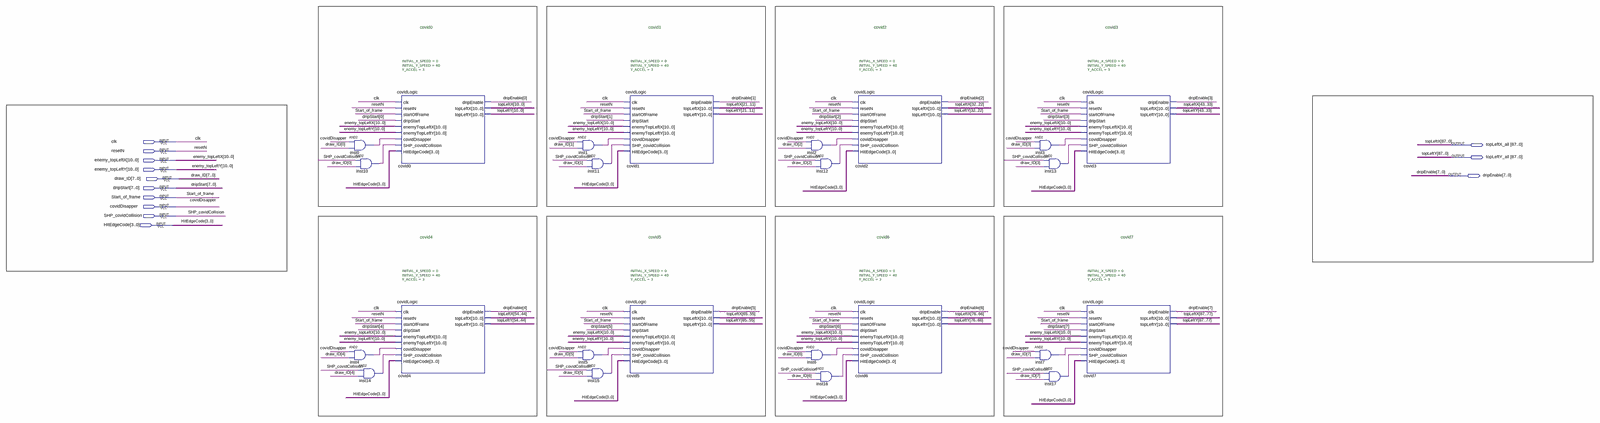
[diagram p0: schematic sheet, whole]
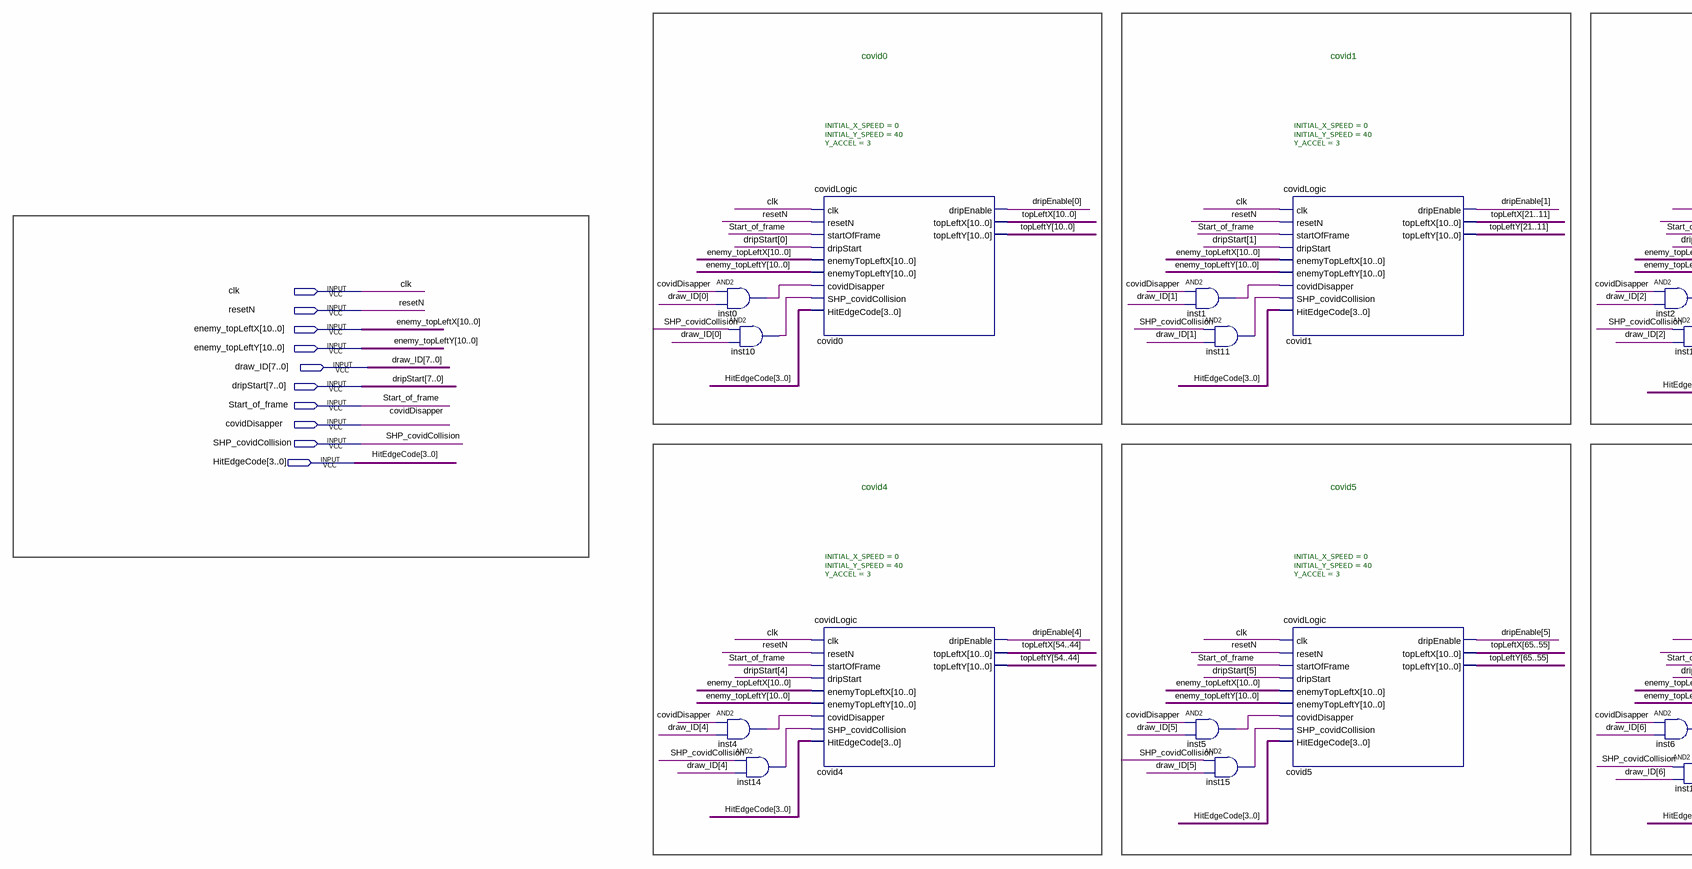
[diagram p1: schematic sheet, left part]
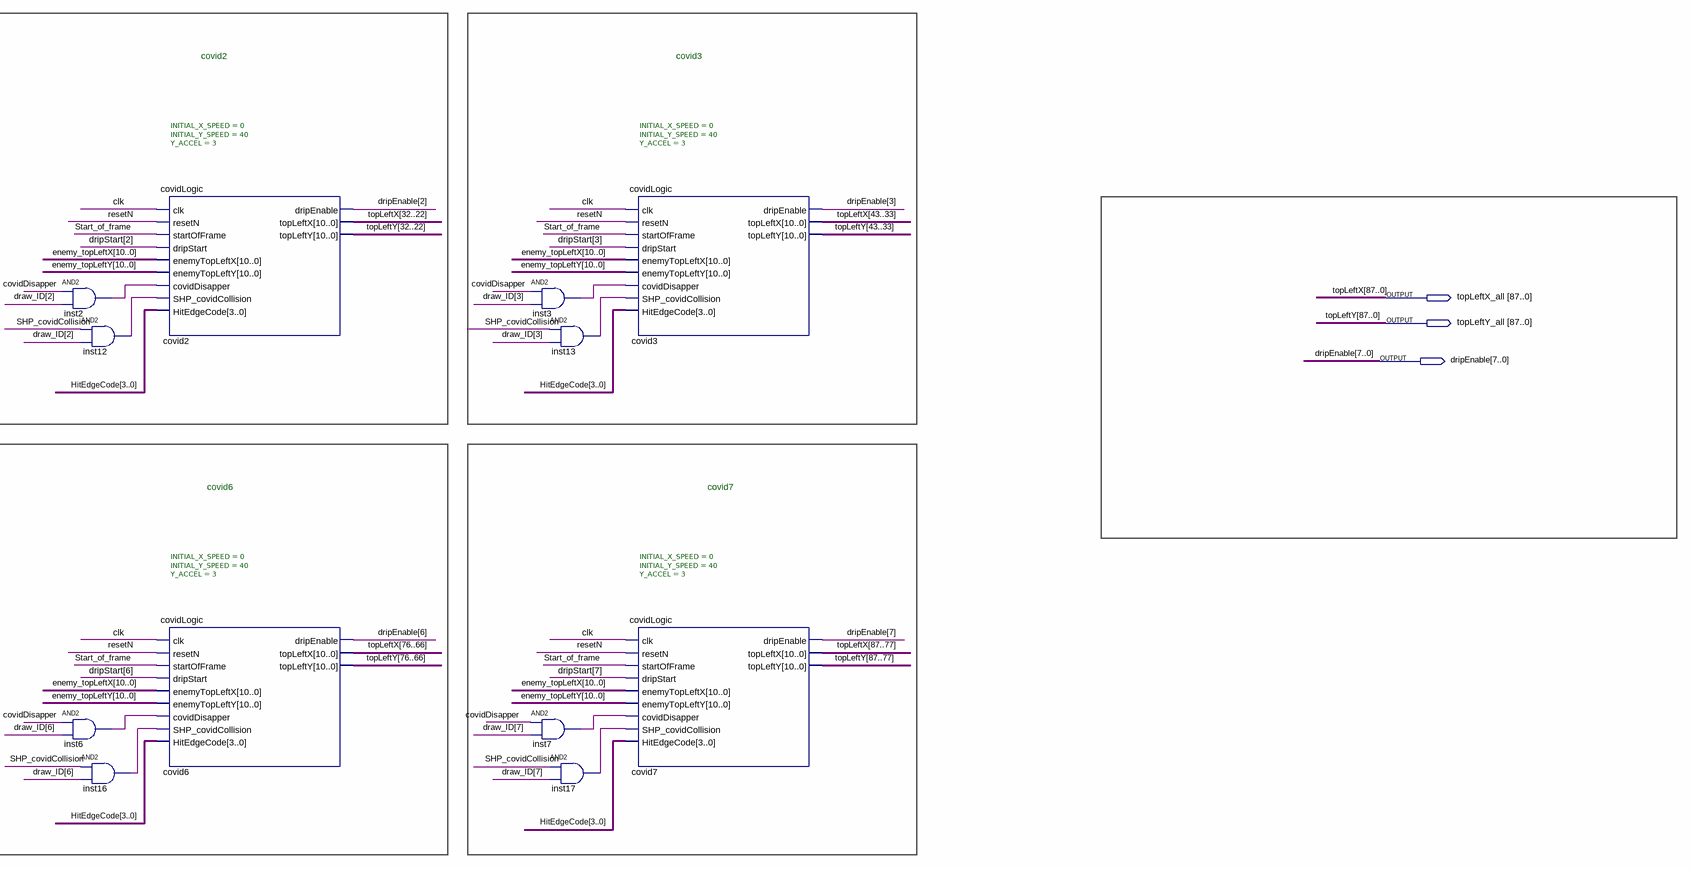
[diagram p2: schematic sheet, right part]
// Quartus schematic covidLogicMaster.bdf as structural Verilog: 24 symbols, 13 pins
module covidLogicMaster (
  input  clk,
  input  resetN,
  input  [10:0] enemy_topLeftX,
  input  [10:0] enemy_topLeftY,
  input  [7:0] draw_ID,
  input  [7:0] dripStart,
  input  Start_of_frame,
  input  covidDisapper,
  input  SHP_covidCollision,
  input  [3:0] HitEdgeCode,
  output [87:0] topLeftX_all,
  output [87:0] topLeftY_all,
  output [7:0] dripEnable
);

  wire inst0_out, inst1_out, inst2_out, inst3_out, inst4_out, inst5_out, inst6_out, inst7_out, inst10_out,
       inst11_out, inst12_out, inst13_out, inst14_out, inst15_out, inst16_out, inst17_out;

  and inst0 (inst0_out, covidDisapper, draw_ID[0]);
  and inst10 (inst10_out, SHP_covidCollision, draw_ID[0]);
  and inst4 (inst4_out, covidDisapper, draw_ID[4]);
  and inst14 (inst14_out, SHP_covidCollision, draw_ID[4]);
  covidLogic #(.INITIAL_X_SPEED(0), .INITIAL_Y_SPEED(40), .Y_ACCEL(3)) covid0 (
    .clk(clk), .resetN(resetN), .startOfFrame(Start_of_frame), .dripStart(dripStart[0]),
    .enemyTopLeftX(enemy_topLeftX), .enemyTopLeftY(enemy_topLeftY), .covidDisapper(inst0_out),
    .SHP_covidCollision(inst10_out), .HitEdgeCode(HitEdgeCode), .dripEnable(dripEnable[0]),
    .topLeftX(topLeftX_all[10:0]), .topLeftY(topLeftY_all[10:0]));
  covidLogic #(.INITIAL_X_SPEED(0), .INITIAL_Y_SPEED(40), .Y_ACCEL(3)) covid4 (
    .clk(clk), .resetN(resetN), .startOfFrame(Start_of_frame), .dripStart(dripStart[4]),
    .enemyTopLeftX(enemy_topLeftX), .enemyTopLeftY(enemy_topLeftY), .covidDisapper(inst4_out),
    .SHP_covidCollision(inst14_out), .HitEdgeCode(HitEdgeCode), .dripEnable(dripEnable[4]),
    .topLeftX(topLeftX_all[54:44]), .topLeftY(topLeftY_all[54:44]));
  and inst1 (inst1_out, covidDisapper, draw_ID[1]);
  and inst5 (inst5_out, covidDisapper, draw_ID[5]);
  and inst11 (inst11_out, SHP_covidCollision, draw_ID[1]);
  and inst15 (inst15_out, SHP_covidCollision, draw_ID[5]);
  covidLogic #(.INITIAL_X_SPEED(0), .INITIAL_Y_SPEED(40), .Y_ACCEL(3)) covid1 (
    .clk(clk), .resetN(resetN), .startOfFrame(Start_of_frame), .dripStart(dripStart[1]),
    .enemyTopLeftX(enemy_topLeftX), .enemyTopLeftY(enemy_topLeftY), .covidDisapper(inst1_out),
    .SHP_covidCollision(inst11_out), .HitEdgeCode(HitEdgeCode), .dripEnable(dripEnable[1]),
    .topLeftX(topLeftX_all[21:11]), .topLeftY(topLeftY_all[21:11]));
  covidLogic #(.INITIAL_X_SPEED(0), .INITIAL_Y_SPEED(40), .Y_ACCEL(3)) covid5 (
    .clk(clk), .resetN(resetN), .startOfFrame(Start_of_frame), .dripStart(dripStart[5]),
    .enemyTopLeftX(enemy_topLeftX), .enemyTopLeftY(enemy_topLeftY), .covidDisapper(inst5_out),
    .SHP_covidCollision(inst15_out), .HitEdgeCode(HitEdgeCode), .dripEnable(dripEnable[5]),
    .topLeftX(topLeftX_all[65:55]), .topLeftY(topLeftY_all[65:55]));
  and inst2 (inst2_out, covidDisapper, draw_ID[2]);
  and inst6 (inst6_out, covidDisapper, draw_ID[6]);
  and inst12 (inst12_out, SHP_covidCollision, draw_ID[2]);
  and inst16 (inst16_out, SHP_covidCollision, draw_ID[6]);
  covidLogic #(.INITIAL_X_SPEED(0), .INITIAL_Y_SPEED(40), .Y_ACCEL(3)) covid2 (
    .clk(clk), .resetN(resetN), .startOfFrame(Start_of_frame), .dripStart(dripStart[2]),
    .enemyTopLeftX(enemy_topLeftX), .enemyTopLeftY(enemy_topLeftY), .covidDisapper(inst2_out),
    .SHP_covidCollision(inst12_out), .HitEdgeCode(HitEdgeCode), .dripEnable(dripEnable[2]),
    .topLeftX(topLeftX_all[32:22]), .topLeftY(topLeftY_all[32:22]));
  covidLogic #(.INITIAL_X_SPEED(0), .INITIAL_Y_SPEED(40), .Y_ACCEL(3)) covid6 (
    .clk(clk), .resetN(resetN), .startOfFrame(Start_of_frame), .dripStart(dripStart[6]),
    .enemyTopLeftX(enemy_topLeftX), .enemyTopLeftY(enemy_topLeftY), .covidDisapper(inst6_out),
    .SHP_covidCollision(inst16_out), .HitEdgeCode(HitEdgeCode), .dripEnable(dripEnable[6]),
    .topLeftX(topLeftX_all[76:66]), .topLeftY(topLeftY_all[76:66]));
  and inst3 (inst3_out, covidDisapper, draw_ID[3]);
  and inst13 (inst13_out, SHP_covidCollision, draw_ID[3]);
  and inst7 (inst7_out, covidDisapper, draw_ID[7]);
  and inst17 (inst17_out, SHP_covidCollision, draw_ID[7]);
  covidLogic #(.INITIAL_X_SPEED(0), .INITIAL_Y_SPEED(40), .Y_ACCEL(3)) covid3 (
    .clk(clk), .resetN(resetN), .startOfFrame(Start_of_frame), .dripStart(dripStart[3]),
    .enemyTopLeftX(enemy_topLeftX), .enemyTopLeftY(enemy_topLeftY), .covidDisapper(inst3_out),
    .SHP_covidCollision(inst13_out), .HitEdgeCode(HitEdgeCode), .dripEnable(dripEnable[3]),
    .topLeftX(topLeftX_all[43:33]), .topLeftY(topLeftY_all[43:33]));
  covidLogic #(.INITIAL_X_SPEED(0), .INITIAL_Y_SPEED(40), .Y_ACCEL(3)) covid7 (
    .clk(clk), .resetN(resetN), .startOfFrame(Start_of_frame), .dripStart(dripStart[7]),
    .enemyTopLeftX(enemy_topLeftX), .enemyTopLeftY(enemy_topLeftY), .covidDisapper(inst7_out),
    .SHP_covidCollision(inst17_out), .HitEdgeCode(HitEdgeCode), .dripEnable(dripEnable[7]),
    .topLeftX(topLeftX_all[87:77]), .topLeftY(topLeftY_all[87:77]));

  // Other names for the same wires on the sheet: topLeftX[87:0] = topLeftX_all; topLeftY[87:0] = topLeftY_all

  // Notes on the sheet:
  //   covid0
  //   covid1
  //   covid2
  //   covid3
  //   covid4
  //   covid5
  //   covid6
  //   covid7
endmodule
